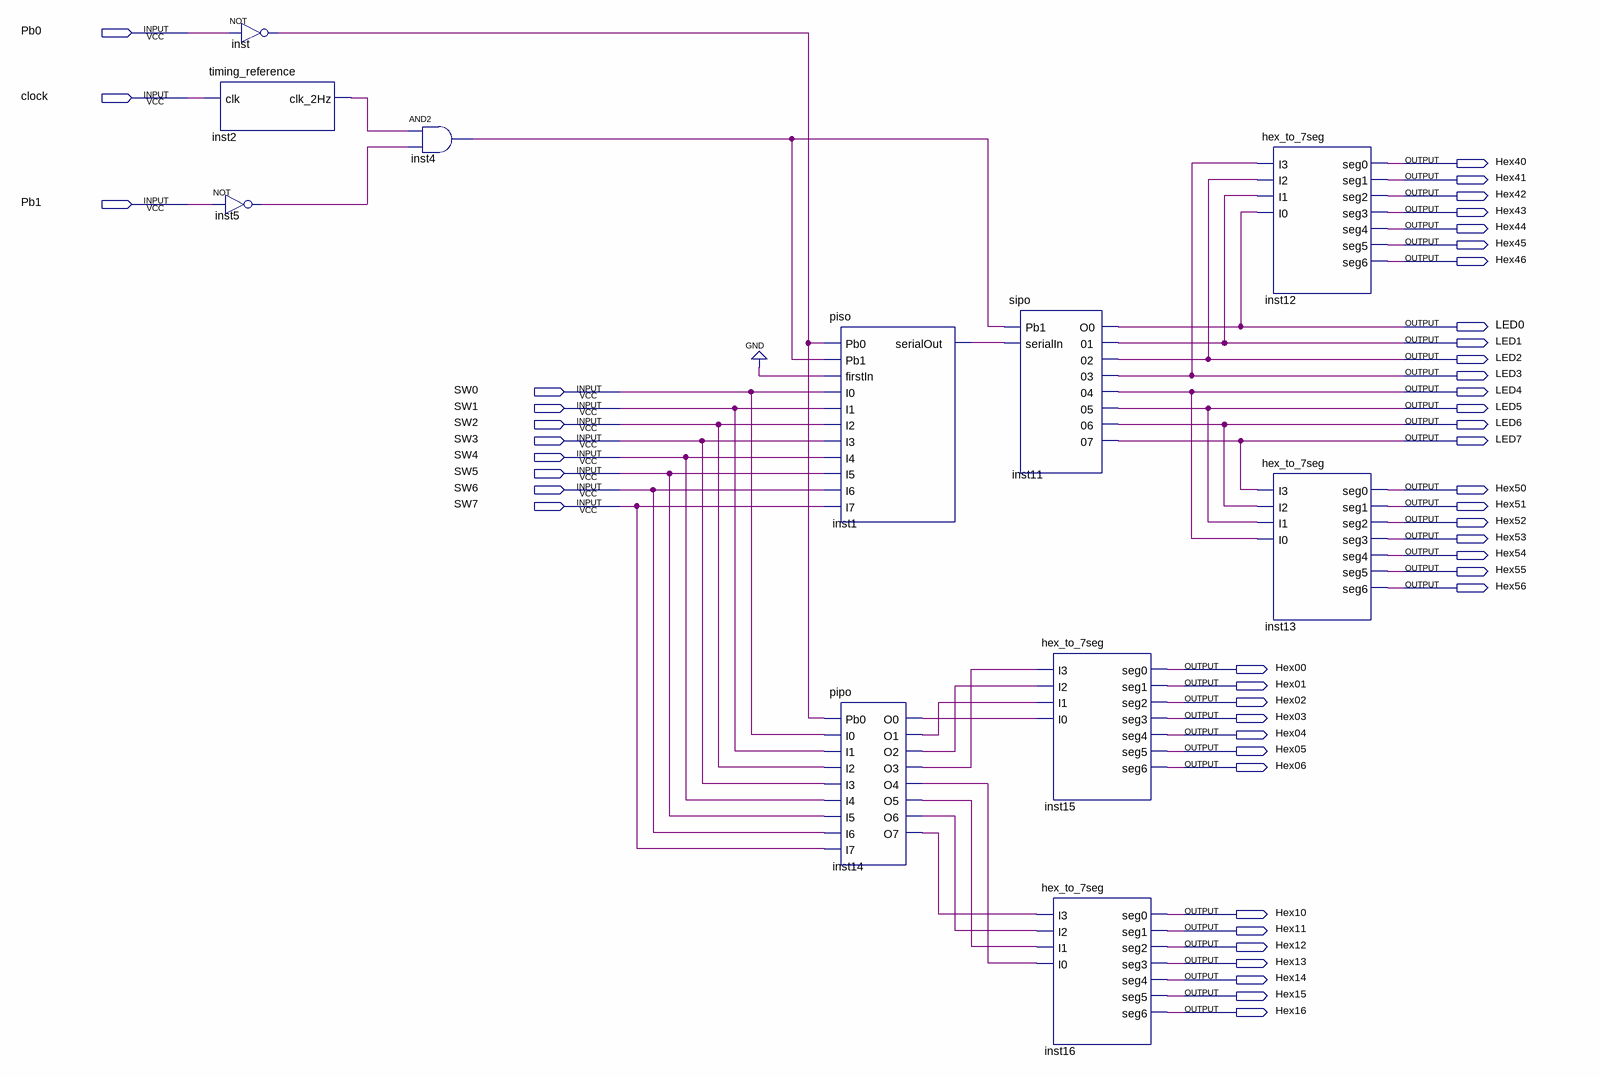
[diagram p0: schematic sheet]
// Quartus schematic lab003.bdf as structural Verilog: 11 symbols, 47 pins
module lab003 (
  input  Pb0,
  input  clock,
  input  Pb1,
  input  SW0,
  input  SW1,
  input  SW2,
  input  SW3,
  input  SW4,
  input  SW5,
  input  SW6,
  input  SW7,
  output Hex40,
  output Hex41,
  output Hex42,
  output Hex43,
  output Hex44,
  output Hex45,
  output Hex46,
  output LED0,
  output LED1,
  output LED2,
  output LED3,
  output LED4,
  output LED5,
  output LED6,
  output LED7,
  output Hex50,
  output Hex51,
  output Hex52,
  output Hex53,
  output Hex54,
  output Hex55,
  output Hex56,
  output Hex00,
  output Hex01,
  output Hex02,
  output Hex03,
  output Hex04,
  output Hex05,
  output Hex06,
  output Hex10,
  output Hex11,
  output Hex12,
  output Hex13,
  output Hex14,
  output Hex15,
  output Hex16
);

  wire inst1_serialout, inst2_clk_2hz, inst4_out, inst5_out, inst14_o0, inst14_o1, inst14_o2, inst14_o3,
       inst14_o4, inst14_o5, inst14_o6, inst14_o7, inst_out;

  not inst (inst_out, Pb0);
  timing_reference inst2 (.clk(clock), .clk_2Hz(inst2_clk_2hz));
  not inst5 (inst5_out, Pb1);
  and inst4 (inst4_out, inst2_clk_2hz, inst5_out);
  piso inst1 (
    .Pb0(inst_out), .Pb1(inst4_out), .firstIn(1'b0), .I0(SW0), .I1(SW1), .I2(SW2), .I3(SW3), .I4(SW4),
    .I5(SW5), .I6(SW6), .I7(SW7), .serialOut(inst1_serialout));
  pipo inst14 (
    .Pb0(inst_out), .I0(SW0), .I1(SW1), .I2(SW2), .I3(SW3), .I4(SW4), .I5(SW5), .I6(SW6), .I7(SW7),
    .O0(inst14_o0), .O1(inst14_o1), .O2(inst14_o2), .O3(inst14_o3), .O4(inst14_o4), .O5(inst14_o5),
    .O6(inst14_o6), .O7(inst14_o7));
  sipo inst11 (
    .Pb1(inst4_out), .serialIn(inst1_serialout), .O0(LED0), .\01 (LED1), .\02 (LED2), .\03 (LED3),
    .\04 (LED4), .\05 (LED5), .\06 (LED6), .\07 (LED7));
  hex_to_7seg inst15 (
    .I3(inst14_o3), .I2(inst14_o2), .I1(inst14_o1), .I0(inst14_o0), .seg0(Hex00), .seg1(Hex01), .seg2(Hex02),
    .seg3(Hex03), .seg4(Hex04), .seg5(Hex05), .seg6(Hex06));
  hex_to_7seg inst16 (
    .I3(inst14_o7), .I2(inst14_o6), .I1(inst14_o5), .I0(inst14_o4), .seg0(Hex10), .seg1(Hex11), .seg2(Hex12),
    .seg3(Hex13), .seg4(Hex14), .seg5(Hex15), .seg6(Hex16));
  hex_to_7seg inst12 (
    .I3(LED3), .I2(LED2), .I1(LED1), .I0(LED0), .seg0(Hex40), .seg1(Hex41), .seg2(Hex42), .seg3(Hex43),
    .seg4(Hex44), .seg5(Hex45), .seg6(Hex46));
  hex_to_7seg inst13 (
    .I3(LED7), .I2(LED6), .I1(LED5), .I0(LED4), .seg0(Hex50), .seg1(Hex51), .seg2(Hex52), .seg3(Hex53),
    .seg4(Hex54), .seg5(Hex55), .seg6(Hex56));
endmodule
